# Altium project power_u_V.0.2.PrjPcb
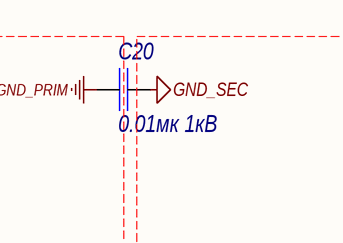
[diagram p0: Sheet2.SchDoc, top left]
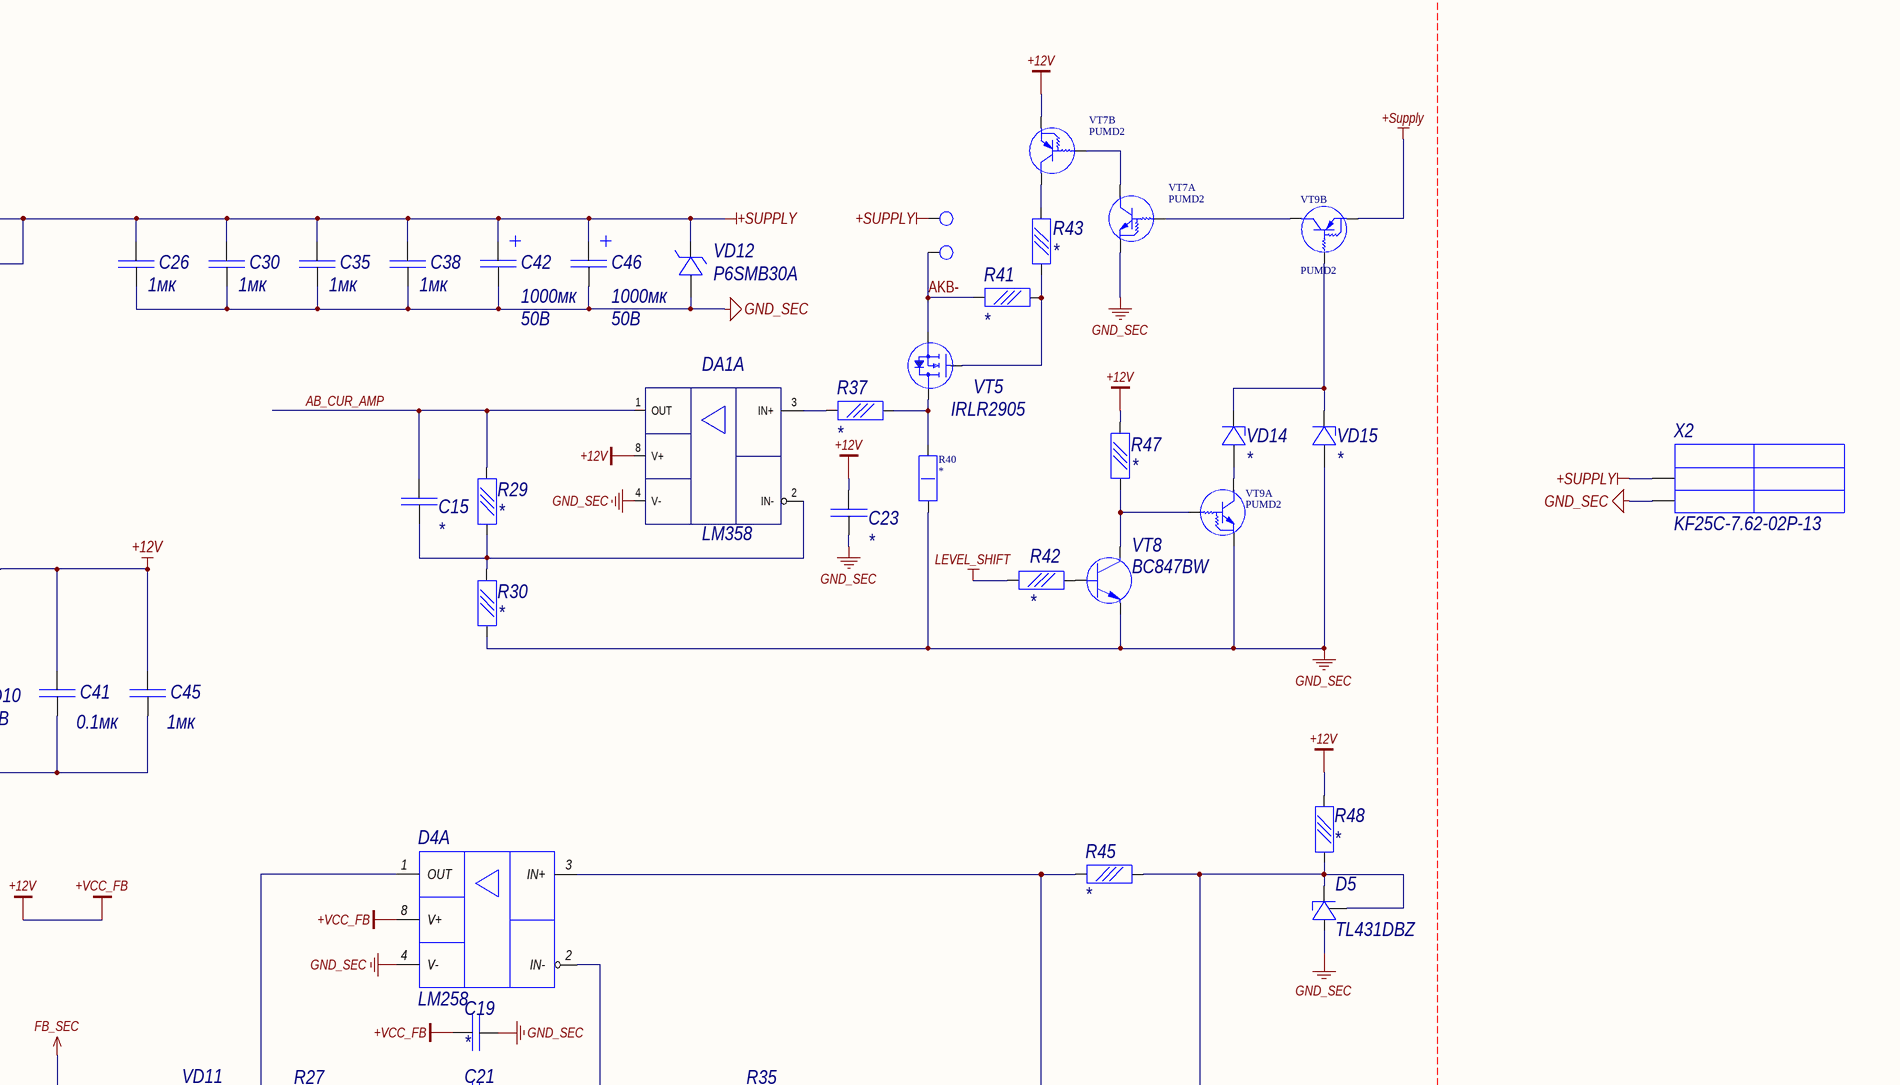
[diagram p1: Sheet2.SchDoc, top right]
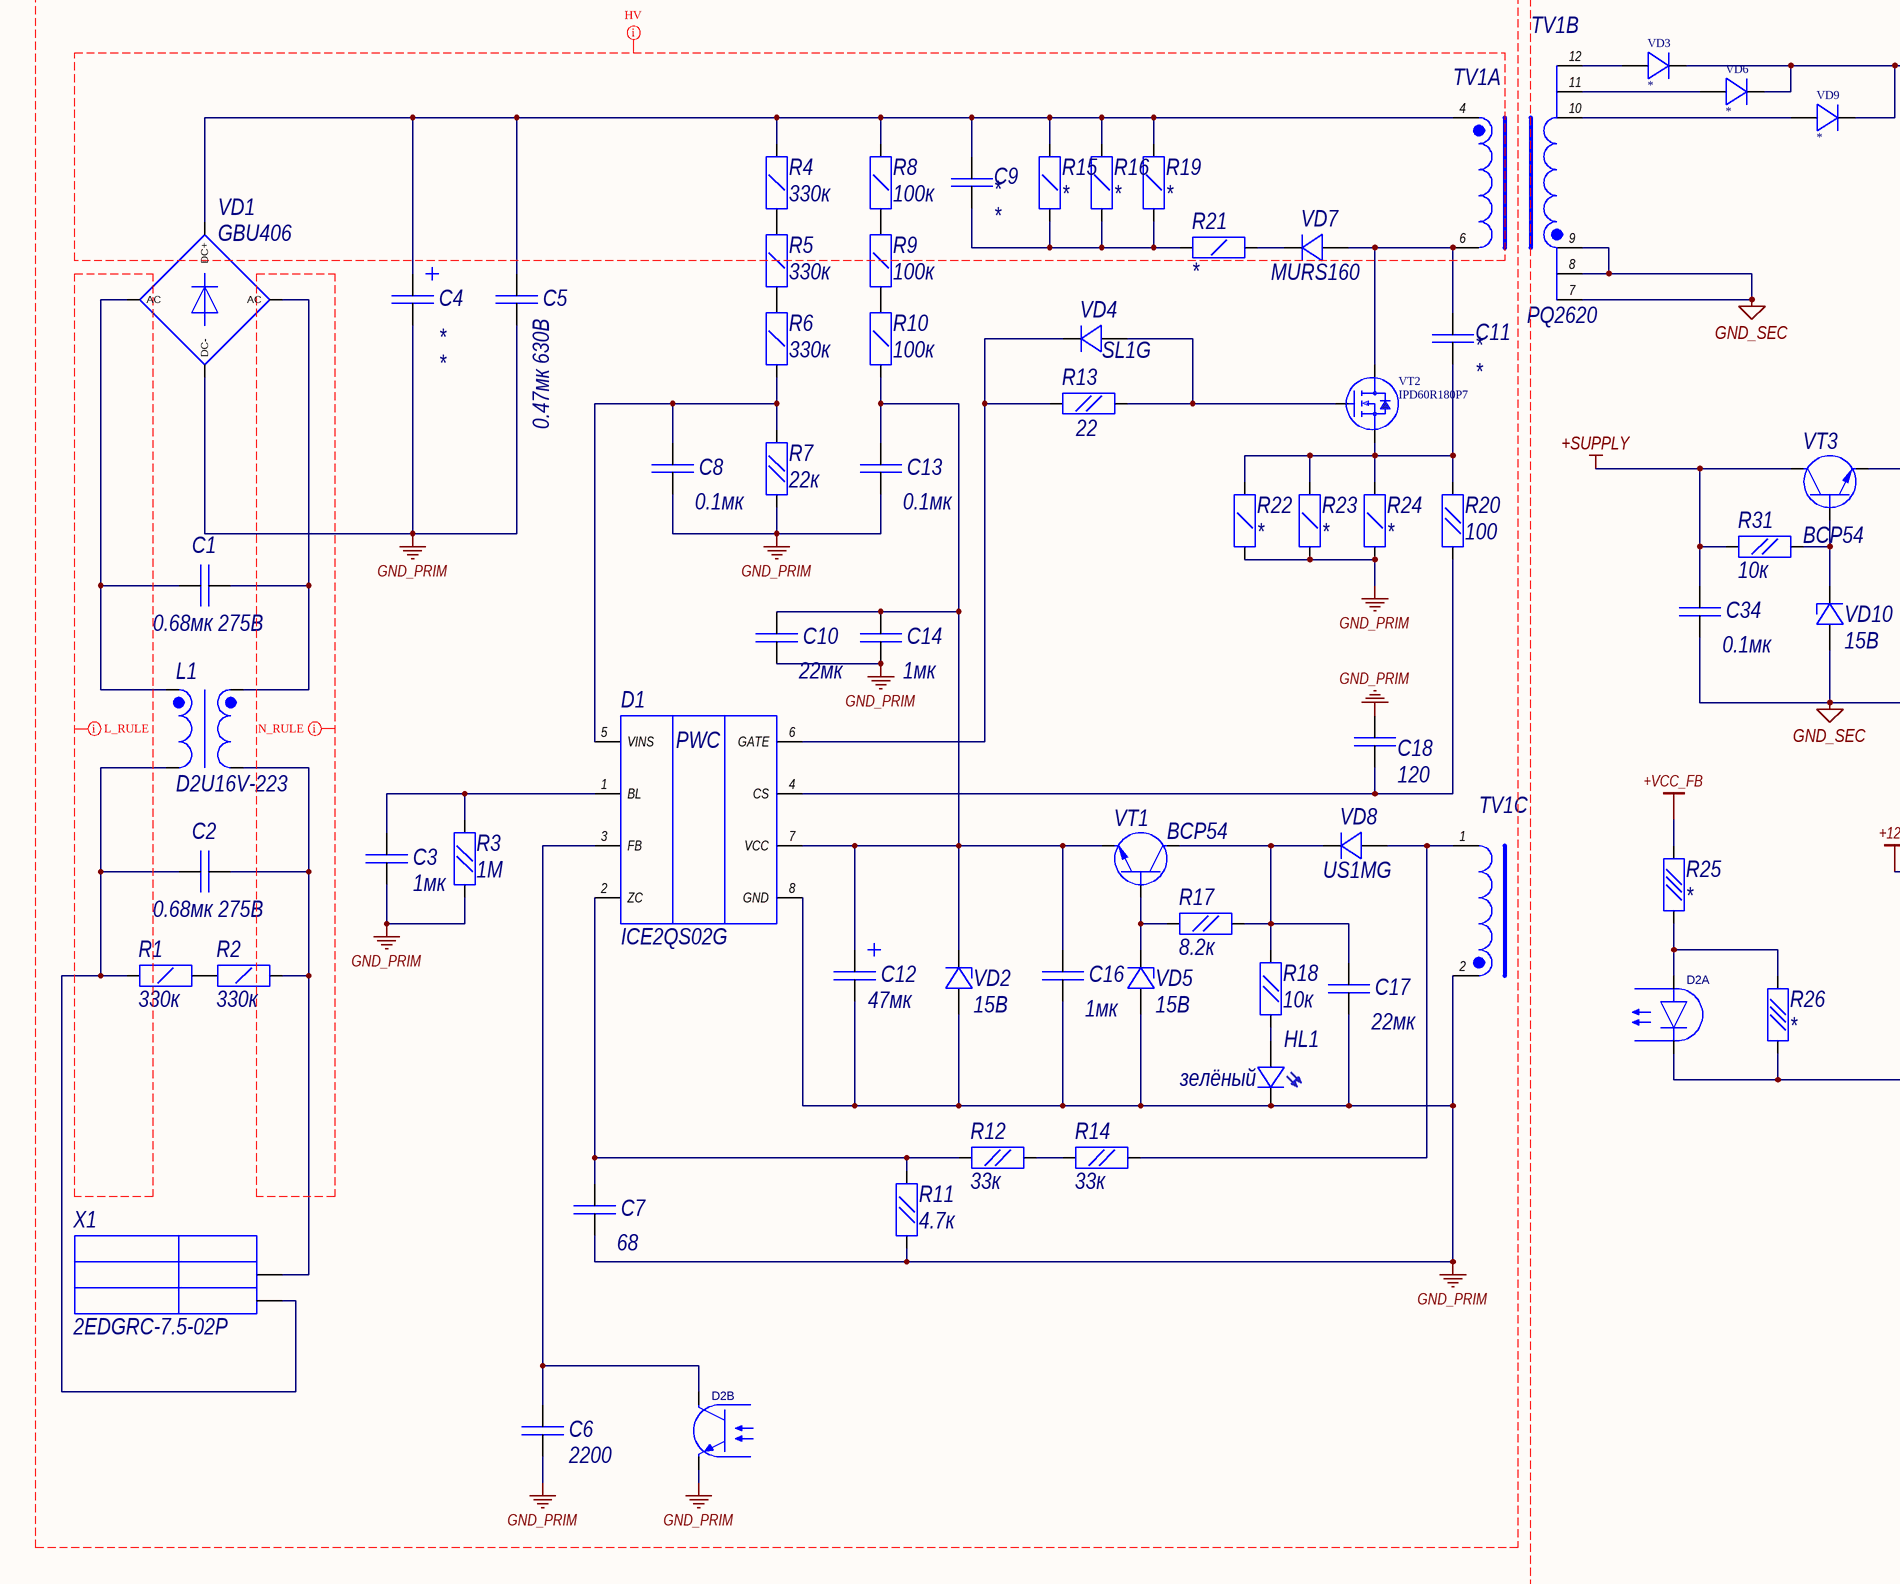
[diagram p2: Sheet2.SchDoc, bottom left]
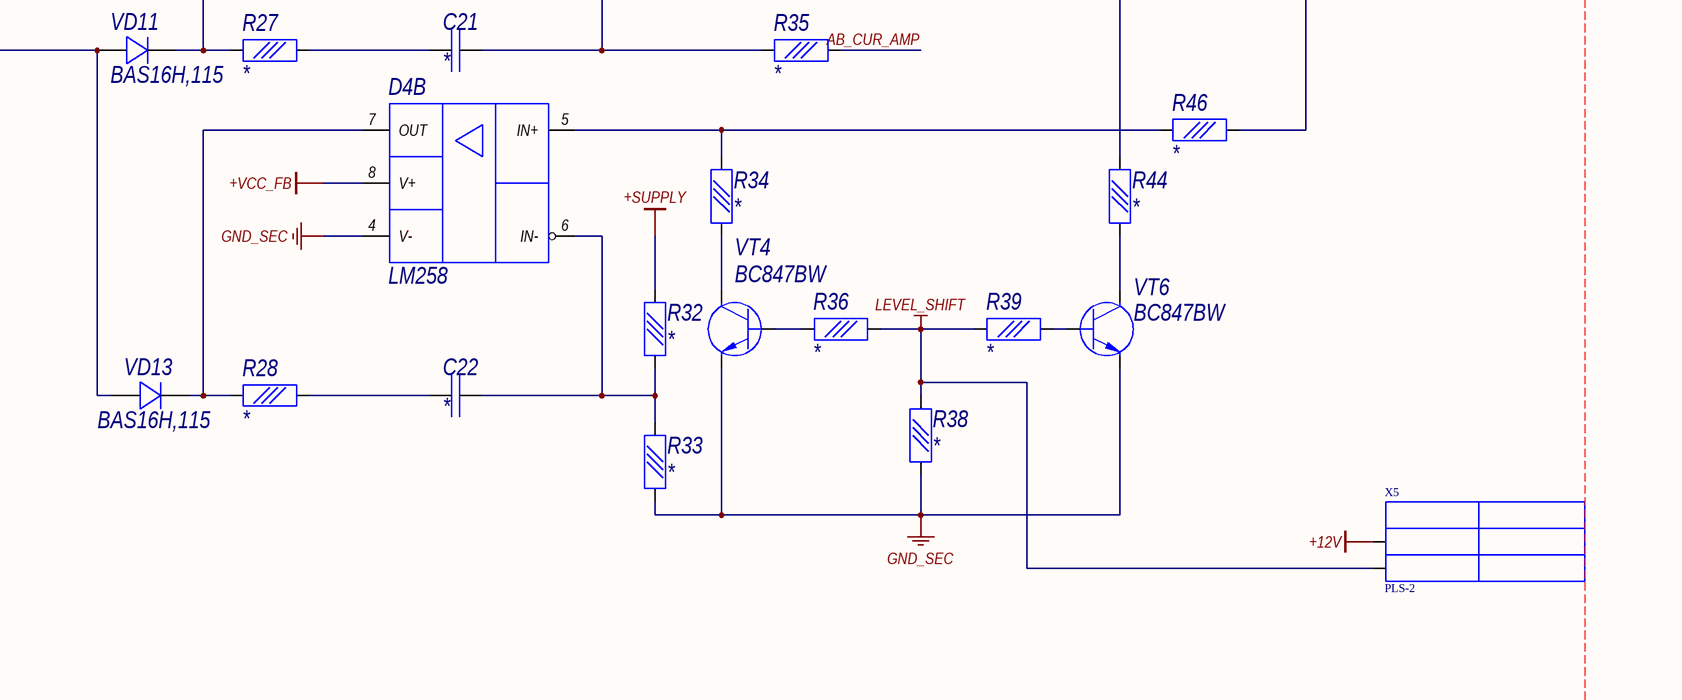
[diagram p3: Sheet2.SchDoc, bottom right]
2 sheets, 127 parts. Net scope: global (net labels, ports and power ports of the same name join across sheets).
Board file: PCB1.PcbDoc
Sheets:
  Sheet2.SchDoc
  Sheet1.SchDoc

## Sheet Sheet2.SchDoc
size 840 x 594 mm; SheetNumber: 1; SheetTotal: 2; Scale: 1:1; Обозначение документа: ААИЧ.425459.001 Э3

### Parts
(Parts that share a designator on the sheet are numbered #1, #2 ... from top to bottom, then left to right.)
C1#1  0.68мк 275В  [FILM_P1500L1800W1100H1400PD80]
C2#1  0.68мк 275В  [FILM_P1500L1800W1100H1400PD80]
C3#1  1мк  [C-0805]
C4  *  [PCAP D18 H36 P7.5]
C5  0.47мк 630В  [CAP23X9X19mm]
C6  2200  [c-0805]
C7#1  68  [c-0805]
C8  0.1мк  [c-0805]
C9  *  [c-1206]
C10  22мк  [c-0805]
C11  *  [c-1206]
C12  47мк  [Capacitor, SM Tantalum; Body 7.3 x 4.3 mm (LxW typ)]
C13  0.1мк  [C-0805]
C14  1мк  [C-0805]
C15  *  [c-0603]
C16  1мк  [C-0805]
C17  22мк  [C-0805]
C18  120  [C-0805]
C19  *  [C-0603]
C20  0.01мк 1кВ  [HVCerCap_d7.5x10]
C21  *  [c-0603]
C22  *  [c-0603]
C23  *  [c-0603]
C26  1мк  [C-0805]
C30  1мк  [C-0805]
C34  0.1мк  [C-0805]
C35  1мк  [C-0805]
C38  1мк  [C-0805]
C41  0.1мк  [C-0805]
C42  1000мк  Voltage: 50В  [CAP: D13C5H25]
C45  1мк  [c-0805]
C46  1000мк  Voltage: 50В  [CAP: D13C5H25]
D1  ICE2QS02G  [8-soic]
D2  PC817  [DIP4-SMD]  (value not drawn)  (parts A,B of 2)
D4  LM258  [8-SOIC]  (parts A,B of 2)
D5  TL431DBZ  [sot-23-3]
DA1  LM358  [8-SOIC]  (part A of 2)
HL1  Color: зелёный  [LED-0805G]  (hidden comment: __GENERIC_LED)
L1#1  D2U16V-223  [UU16]
R1#1  330к  [R-1206]
R2#1  330к  [R-1206]
R3  1М  [R-0805]
R4  330к  [R-1206]
R5  330к  [R-1206]
R6  330к  [R-1206]
R7  22к  [R-0805]
R8  100к  [R-1206]
R9  100к  [R-1206]
R10  100к  [R-1206]
R11  4.7к  [R-0805]
R12  33к  [R-0805]
R13  22  [R-0805]
R14  33к  [R-0805]
R15  *  [R-1206]
R16  *  [R-1206]
R17  8.2к  [R-0805]
R18  10к  [R-0805]
R19  *  [R-1206]
R20  100  [R-0805]
R21  *  [R-1206]
R22  *  [R-1206]
R23  *  [R-1206]
R24  *  [R-1206]
R25  *  [r-0603]
R26  *  [r-0603]
R27  *  [r-0603]
R28  *  [r-0603]
R29  *  [r-0603]
R30  *  [r-0603]
R31  10к  [R-0805]
R32  *  [r-0603]
R33  *  [r-0603]
R34  *  [r-0603]
R35  *  [R-0603]
R36  *  [r-0603]
R37  *  [r-0603]
R38  *  [r-0603]
R39  *  [r-0603]
R40  *  [r-2512]
R41  *  [r-0603]
R42  *  [r-0603]
R43  *  [r-0603]
R44  *  [r-0603]
R45  *  [r-0603]
R46  *  [r-0603]
R47  *  [r-0603]
R48  *  [r-0603]
TV1  PQ3535  [PQ2620]  (value not drawn)  (parts A,B,C of 3)
VD1#1  GBU406  [GBU406]
VD2  15В  [MICROMELF(SOD80)]
VD3  *  [DO-214AC]
VD4  SL1G  [SOD-123FL]
VD5  15В  [MICROMELF(SOD80)]
VD6  *  [DO-214AC]
VD7  MURS160  [DO-214AA]
VD8  US1MG  [DO-214AC]
VD9  *  [DO-214AC]
VD10  15В  [MICROMELF(SOD80)]
VD11  BAS16H,115  [SOD-123FL]
VD12  P6SMB30A  [DO-214AA]
VD13  BAS16H,115  [SOD-123FL]
VD14  *  [MICROMELF(SOD80)]
VD15  *  [MICROMELF(SOD80)]
VT1  BCP54  [SOT-223-4]
VT2  IPD60R180P7  [TO-252]
VT3  BCP54  [SOT-223-4]
VT4  BC847BW  [SOT-323-3]
VT5  IRLR2905  [TO-263-3]
VT6  BC847BW  [SOT-323-3]
VT7  PUMD2  [SOT-323-6]  (parts A,B of 2)
VT8  BC847BW  [SOT-323-3]
VT9  PUMD2  [SOT-323-6]  (parts A,B of 2)
X1  2EDGRC-7.5-02P  [2EDGRC-7.5-02P]
X2#1  KF25C-7.62-02P-13  [KF25C-7.62-02P-13]
X3#1  Клема +  [PAD3MM]  (value not drawn)  (net tie, no BOM)
X4  Клема -  [PAD3MM]  (value not drawn)  (net tie, no BOM)
X5  PLS-2  [PLS-2]

### Nets
+12V: C19.1 C23.2 C41.1 C45.1 D4.8(V+) DA1.8(V+) R25.2 R47.2 R48.1 VT3.3(E) VT7.4(E) X5.1  [also labelled +VCC_FB]
+SUPPLY: C26.2 C30.2 C34.1 C35.2 C38.2 C42.1 C46.1 R31.2 R32.1 VD3.K VD6.K VD9.K VD12.K VT3.2(C) VT9.4(E) X2#1.1 X3#1.1
FB_SEC: D2.2(K) R26.1 VD11.1 VD13.1
GND_PRIM: C3#1.1 C4.2 C5.1 C6.1 C7#1.2 C8.2 C10.2 C12.2 C13.2 C14.2 C16.2 C17.2 C18.2 C20.1 D1.8(GND) D2.3(E) HL1.K R3.2 R7.1 R11.1 R22.1 R23.1 R24.1 TV1.2 VD1#1.-(DC-) VD2.A VD5.A
GND_SEC: C19.2 C20.2 C23.1 C26.1 C30.1 C34.2 C35.1 C38.1 C41.2 C42.2 C45.2 C46.2 D4.4(V-) D5.3(A) DA1.4(V-) R30.2 R33.2 R38.2 R40.1 TV1.7 TV1.8 TV1.9 VD10.A VD12.A VD15.A VT4.2(E) VT6.2(E) VT7.1(E) VT8.2(E) VT9.1(E) X2#1.2
LEVEL_SHIFT: R36.2 R38.1 R39.1 R42.2 X5.2
AB_CUR_AMP: C15.2 DA1.1(OUT) R29.1 R35.1
AKB-: R41.2 VT5.3(S) X4.1
NetC1#1_1: C1#1.1 L1#1.2(S1) VD1#1.AC2(AC)
NetC1#1_2: C1#1.2 L1#1.4(S2) VD1#1.AC1(AC)
NetC2#1_1: C2#1.1 L1#1.1(E1) R1#1.2 X1.2
NetC2#1_2: C2#1.2 L1#1.3(E2) R2#1.1 X1.1
NetC3#1_2: C3#1.2 D1.1(BL) R3.1
NetC4_1: C4.1 C5.2 C9.2 R4.2 R8.2 R15.2 R16.2 R19.2 TV1.4 VD1#1.+(DC+)
NetC6_2: C6.2 D1.3(FB) D2.4(C)
NetC7#1_1: C7#1.1 D1.2(ZC) R11.2 R12.1
NetC8_1: C8.1 D1.5(VINS) R6.1 R7.2
NetC9_1: C9.1 R15.1 R16.1 R19.1 R21.2
NetC10_1: C10.1 C12.1 C13.1 C14.1 C16.1 D1.7(VCC) R10.1 VD2.K VT1.3(E)
NetC11_1: C11.1 R20.1 R22.2 R23.2 R24.2 VT2.S
NetC11_2: C11.2 TV1.6 VD7.A VT2.D
NetC15_1: C15.1 DA1.2(IN-) R29.2 R30.1
NetC17_1: C17.1 R17.1 R18.1 VD8.K VT1.2(C)
NetC18_1: C18.1 D1.4(CS) R20.2
NetC21_1: C21.1 R27.1
NetC21_2: C21.2 D4.2(IN-) R35.2
NetC22_1: C22.1 R28.1
NetC22_2: C22.2 D4.6(IN-) R32.2 R33.1
NetD1_6: D1.6(GATE) R13.1 VD4.K
NetD2_1: D2.1(A) R25.1 R26.2
NetD4_1: D4.1(OUT) R27.2 VD11.2
NetD4_3: D4.3(IN+) R44.2 R45.2
NetD4_5: D4.5(IN+) R34.2 R46.2
NetD4_7: D4.7(OUT) R28.2 VD13.2
NetD5_1: D5.1(K) D5.2(R) R45.1 R46.1 R48.2
NetDA1_3: DA1.3(IN+) R37.2
NetHL1_A: HL1.A R18.2
NetR1#1_1: R1#1.1 R2#1.2
NetR4_1: R4.1 R5.2
NetR5_1: R5.1 R6.2
NetR8_1: R8.1 R9.2
NetR9_1: R9.1 R10.2
NetR12_2: R12.2 R14.1
NetR13_2: R13.2 VD4.A VT2.G
NetR14_2: R14.2 TV1.1 VD8.A
NetR17_2: R17.2 VD5.K VT1.1(B)
NetR21_1: R21.1 VD7.K
NetR31_1: R31.1 VD10.K VT3.1(B)
NetR34_1: R34.1 VT4.3(C)
NetR36_1: R36.1 VT4.1(B)
NetR37_1: R37.1 R40.2 VT5.2(D)
NetR39_2: R39.2 VT6.1(B)
NetR41_1: R41.1 R43.2 VT5.1(G)
NetR42_1: R42.1 VT8.1(B)
NetR43_1: R43.1 VT7.3(C)
NetR44_1: R44.1 VT6.3(C)
NetR47_1: R47.1 VT8.3(C) VT9.2(B)
NetTV1_10: TV1.10 VD9.A
NetTV1_11: TV1.11 VD6.A
NetTV1_12: TV1.12 VD3.A
NetVD14_A: VD14.A VT9.6(C)
NetVD14_K: VD14.K VD15.K VT9.5(B)
NetVT7_2: VT7.2(B) VT9.3(C)
NetVT7_5: VT7.5(B) VT7.6(C)

### Layout directives
net class L: (no net found under the mark)
net class N: (no net found under the mark)
net class HV: (no net found under the mark)
net class PRI: GND_PRIM

### Notes on the sheet
- Перв. примен.
- Справ. №
- Подп. и дата
- Инв. № дубл.
- Взам. инв. №
- Разраб.
- Изм.
- Лист
- № докум.
- Подп.
- Дата
- Лит.
- Масса
- Масштаб
- Пров.
- Т.контр.
- Листов
- Инв. № подл.
- Утв.
- Н.контр.
- Копировал
- Формат А1
- (in symbol ICE2QS02G) PWC

### Library data of the parts
C1#1 C2#1 = FILM_CAP: Конденсатор пленочный; Dielectric: X2; Voltage: 275В; ComponentDescription: =ComponentType+', '+Value+', '+Voltage+', '+Dielectric+', '+Package; ComponentType: Конденсатор пленочный; Package: FILM_P1500L1800W1100H1400PD80; Value: 0.68мк
C3#1 C6 C8 C13 C14 C16 C26 C30 C34 C35 C38 C41 C45 = C0805: Voltage: 50; Dielectric: X7R; ComponentDescription: =ComponentType+', '+Package+', '+Voltage+'В, '+Value+', '+Dielectric; ComponentType: Конденсатор керамический SMD
  C3#1 C14 C16 C26 C30 C35 C38: Package: C-0805; Value: 1мк
  C6: Package: c-0805; Value: 2200
  C8: Package: c-0805; Value: 0.1мк
  C13 C34 C41: Package: C-0805; Value: 0.1мк
  C45: Package: c-0805; Value: 1мк
C4 = Aluminum electrolytic capacitor: Конденсатор электролитический; ComponentDescription: =ComponentType+', '+Value+', '+Voltage+', '+Type+', '+Package; ComponentType: Конденсатор электролитический; Package: PCAP D18 H36 P7.5; Type: *; Voltage: *; Value: *
C5 = CBB22 0.47uF 630V: Конденсатор металло-плёночный; Dielectric: СВВ22; Voltage: 630В; ComponentDescription: =ComponentType+', '+Value+', '+Voltage+', '+Dielectric+', '+Package; ComponentType: Конденсатор металло-плёночный; Package: CAP23X9X19mm; Value: 0.47мк
C7#1 C18 = C0805: Voltage: 50; Dielectric: COG; ComponentDescription: =ComponentType+', '+Package+', '+Voltage+'В, '+Value+', '+Dielectric; ComponentType: Конденсатор керамический SMD
  C7#1: Package: c-0805; Value: 68
  C18: Package: C-0805; Value: 120
C9 C11 = C1206: Voltage: *; ComponentDescription: =ComponentType+', '+Package+', '+Voltage+'В, '+Value+', '+Dielectric; ComponentType: Конденсатор керамический SMD; Dielectric: *; Package: c-1206; Value: *
C10 C17 = C0805: Voltage: 25; Dielectric: X7R; ComponentDescription: =ComponentType+', '+Package+', '+Voltage+'В, '+Value+', '+Dielectric; ComponentType: Конденсатор керамический SMD; Value: 22мк
  C10: Package: c-0805
  C17: Package: C-0805
C12 = _GENERIC_TANTALUM_: Конденсатор танталовый SMD; Voltage: 25; Dielectric: Типоразмер D; ComponentDescription: =ComponentType+', '+Package+', '+Voltage+'В, '+Value+', '+Dielectric; ComponentType: Конденсатор танталовый SMD; Package: Capacitor, SM Tantalum; Body 7.3 x 4.3 mm (LxW typ); Value: 47мк
C15 C19 C21-C23 = C0603: Value: *; ComponentType: Конденсатор керамический SMD; Voltage: *; Dielectric: *; ComponentDescription: =ComponentType+', '+Package+', '+Voltage+'В, '+Value+', '+Dielectric
  C15 C21-C23: Package: c-0603
  C19: Package: C-0603
C20 = HVCerCap_d7.5X10: Конденсатор керамический; Dielectric: Y2; Voltage: 1кВ; ComponentDescription: =ComponentType+', '+Value+', '+Voltage+', '+Dielectric+', '+Package; ComponentType: Конденсатор керамический; Package: HVCerCap_d7.5x10; Value: 0.01мк
C42 C46 = CAP: D13C5H25: Конденсатор электролитический; Type: LOW ESR; Dielectric: ESR; ComponentDescription: =ComponentType+', '+Value+', '+Voltage+', '+Dielectric+', '+Package; ComponentType: Конденсатор электролитический; Package: CAP: D13C5H25; Value: 1000мк
D1 = ICE2QS02G: Микросхема контроллер PWM; ComponentDescription: =ComponentTypе+', '+Comment+', '+Package; ComponentTypе: Микросхема контроллер PWM; Package: 8-soic
D2 = PC817: Оптрон с транзисторным выходом; ComponentDescription: =ComponentType+', '+Comment+', '+Package; Package: DIP4-SMD; ComponentType: Оптрон с транзисторным выходом
D4 = LM258: Микросхема сдвоенный ОУ; ComponentDescription: =ComponentTypе+', '+Comment+', '+Package; ComponentTypе: Микросхема сдвоенный ОУ; Package: 8-SOIC
D5 = TL431DBZ: Микросхема ИОН; ComponentDescription: =ComponentType+', '+Comment+', '+Package; Package: sot-23-3; ComponentType: Микросхема ИОН
DA1 = LMV358: Value: LM358; ComponentDescription: LM358
HL1 = __GENERIC_LED: Светодиод; pin to pad: A>1 K>2; ComponentDescription: =ComponentType+', '+Color+', '+Comment+', '+Package; ComponentType: Светодиод; Package: LED-0805G
L1#1 = U16-123: Дроссель синфазный; ComponentDescription: =ComponentTypе+', '+Comment+', '+Package; ComponentTypе: Дроссель синфазный; Package: UU16
R1#1 R2#1 R4-R6 R8-R10 R15 R16 R19 R21-R24 = R1206: Резистор SMD; Tolerance: 5%; ComponentDescription: =ComponentType+', '+ Package +', '+Value+'Ом, ' + Tolerance; ComponentType: Резистор SMD; Package: R-1206
  R1#1 R2#1 R4-R6: Value: 330к
  R8-R10: Value: 100к
  R15 R16 R19 R21-R24: Value: *
R3 R7 R11-R14 R17 R18 R20 R31 = R0805: Резистор SMD; Tolerance: 5%; ComponentDescription: =ComponentType+', '+ Package +', '+Value+'Ом, ' + Tolerance; ComponentType: Резистор SMD; Package: R-0805
  R3: Value: 1М
  R7: Value: 22к
  R11: Value: 4.7к
  R12 R14: Value: 33к
  R13: Value: 22
  R17: Value: 8.2к
  R18 R31: Value: 10к
  R20: Value: 100
R25-R30 R32-R39 R41-R48 = R0603: Резистор SMD; Tolerance: 5%; Value: *; ComponentType: Резистор SMD; ComponentDescription: =ComponentType+', '+ Package +', '+Value+'Ом, ' + Tolerance
  R25-R30 R32-R34 R36-R39 R41-R48: Package: r-0603
  R35: Package: R-0603
R40 = R2512: Резистор SMD; Tolerance: 5%; ComponentDescription: =ComponentType+', '+ Package +', '+Value+'Ом, ' + Tolerance; ComponentType: Резистор SMD; Package: r-2512; Value: *
TV1 = PQ3535_1: Трансформатор FLYBACK 150WT; ComponentDescription: PQ3535
VD1#1 = GBU406: Диодный мост, однофазный; ComponentDescription: =ComponentType+', '+Comment+', '+Package; ComponentType: Диодный мост, однофазный; Package: GBU406
VD2 VD5 VD10 VD14 VD15 = BZM55: Диод Зенера (стабилитрон); pin to pad: A>1 K>2; ComponentDescription: =ComponentType+', '+ComponentName+' '+Comment+', '+Package; ComponentType: Диод Зенера (стабилитрон); Package: MICROMELF(SOD80); ComponentName: BZM55
VD3 VD6 VD9 = SS22A: Диод выпрямительный одиночный; pin to pad: A>1 K>2; ComponentDescription: =ComponentType+', '+Comment+', '+Package; ComponentType: Диод выпрямительный одиночный; Package: DO-214AC
VD4 = SL1G: Диод выпрямительный одиночный; pin to pad: A>1 K>2; ComponentDescription: =ComponentType+', '+Comment+', '+Package; ComponentType: Диод выпрямительный одиночный; Package: SOD-123FL
VD7 = MURS160: Диод выпрямительный одиночный; pin to pad: A>1 K>2; ComponentDescription: =ComponentType+', '+Comment+', '+Package; ComponentType: Диод выпрямительный одиночный; Package: DO-214AA
VD8 = US1MG: Диод выпрямительный одиночный; pin to pad: A>1 K>2; ComponentDescription: =ComponentType+', '+Comment+', '+Package; ComponentType: Диод выпрямительный одиночный; Package: DO-214AC
VD11 VD13 = BAS16H,115: DIODE GP 100V 215MA SOD-123F; Manufacturer: Nexperia USA Inc.; Capacitance @ Vr, F: 1.5pF @ 0V, 1MHz; Current - Average Rectified (Io): 215mA (DC); Current - Reverse Leakage @ Vr: 500 nA @ 80 V; Diode Type: Standard; Speed: Fast Recovery =< 500ns, > 200mA (Io); Voltage - Forward (Vf) (Max) @ If: 1.25 V @ 150 mA; Reverse Recovery Time (trr): 4 ns; Part Number: BAS16H,115; Component Kind: Standard; Component Type: Standard; ComponentLink2Description: DigiKey Link; ComponentLink2URL: https://www.digikey.com/en/products/detail/nexperia-usa-inc/BAS16H-115/1163692; LastUpdated: 19.09.2022 13:46:32; Lifecycle Status: Active; Minimum Order: 1; Mounting Type: Surface Mount; Packaging: TapeAndReel; PartId: 1129; Pin Count: 2; Price: 0.02; Supplier 1: DigiKey; Supplier Device Package: SOD-123F; Supplier Part Number 1: 1727-4796-1-ND; Voltage - DC Reverse (Vr) (Max): 100 V; ComponentLink1Description: Datasheet; ComponentLink1URL: https://assets.nexperia.com/DO-cuments/data-sheet/BAS16_SER.pdf; Operating Temperature - Junction: 150°C (Max); Part Status: Active; Series: Automotive, AEC-Q101, BAS16; Package / Case: SOD-123F
VD12 = P6SMB30A: Защитный диод униполярный; pin to pad: A>1 K>2; ComponentDescription: =ComponentType+', '+Comment+', '+Package; ComponentType: Защитный диод униполярный; Package: DO-214AA
VT1 VT3 = BCP54: ChannelType: NPN; ComponentType: Транзистор биполярный; Package: SOT-223-4; ComponentDescription: =ComponentType+', '+ChannelType+', '+Comment+', '+Package
VT2 = IPD60R180P7: Транзистор МОП, одиночный, N-канальный; pin to pad: D>4 G>1 S>3; ComponentDescription: =ComponentType+', '+ChannelType+', '+Comment+', '+Package; ChannelType: N-канальный; ComponentType: Транзистор МОП, одиночный; Package: TO-252
VT4 VT6 VT8 = BC847BW: ChannelType: NPN; ComponentType: Транзистор биполярный; ComponentDescription: =ComponentType+', '+ChannelType+', '+Comment+', '+Package; Package: SOT-323-3
VT7 VT9 = PUMD2: ChannelType: NPN-PNP; ComponentDescription: =ComponentType+', '+ChannelType+', '+Comment+', '+Package; ComponentType: Цифровая сборка; Package: SOT-323-6
X1 = 2EDGRC-7.5-02P: Разъем разрывной; ComponentDescription: Разъём, 2EDGRC-7.5-02P; ComponentTypе: Разъём
X2#1 = KF25C-7.62-02P-13: Разъём винтовой; ComponentDescription: Разъём винтовой, KF25C-7.62-02P-13; ComponentTypе: Разъём винтовой
X3#1 X4 = PAD1mm
X5 = PLS-2: Разъём штыревой; ComponentDescription: Разъём штыревой, PLS-2; ComponentTypе: Разъём штыревой
VT5 = IRLR2905: ComponentDescription: IRLR2905; Value: IRLR2905

## Sheet Sheet1.SchDoc
size A3; SheetNumber: 2; SheetTotal: 2
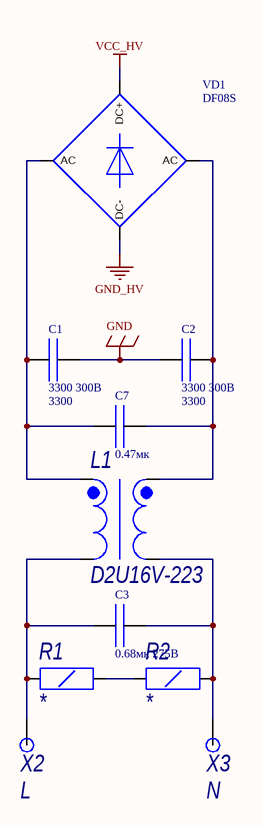
[diagram p4: Sheet1.SchDoc]

### Parts
(Parts that share a designator on the sheet are numbered #1, #2 ... from top to bottom, then left to right.)
C1#2  3300 300В  value 3300  [HVCerCap_d7.5x10]
C2#2  3300 300В  value 3300  [HVCerCap_d7.5x10]
C3#2  0.68мк 275В  [FILM_P1500L1800W1100H1400PD80]
C7#2  value 0.47мк  [CAP23X9X19mm]  (hidden comment: 0.47мк 630В)
L1#2  D2U16V-223  [UU16]
R1#2  *  [R-1206]
R2#2  *  [R-1206]
VD1#2  DF08S  [SDIP 4L]
X2#2  L  [PAD_TOP_10x10]  (net tie, no BOM)
X3#2  N  [PAD_TOP_10x10]  (net tie, no BOM)

### Nets
GND: C1#2.2 C2#2.1
GND_HV: VD1#2.DC-
VCC_HV: VD1#2.DC+
NetC1#2_1: C1#2.1 C7#2.1 L1#2.4(S2) VD1#2.AC2(AC)
NetC2#2_2: C2#2.2 C7#2.2 L1#2.2(S1) VD1#2.AC1(AC)
NetC3#2_1: C3#2.1 L1#2.3(E2) R1#2.1 X2#2.1
NetC3#2_2: C3#2.2 L1#2.1(E1) R2#2.2 X3#2.1
NetR1#2_2: R1#2.2 R2#2.1

### Library data of the parts
C1#2 C2#2 = HVCerCap_d7.5X10: Конденсатор керамический; Dielectric: Y2; Voltage: 300В; ComponentDescription: =ComponentType+', '+Value+', '+Voltage+', '+Dielectric+', '+Package; ComponentType: Конденсатор керамический; Package: HVCerCap_d7.5x10
C3#2 = FILM_CAP: Конденсатор пленочный; Dielectric: X2; Voltage: 275В; ComponentDescription: =ComponentType+', '+Value+', '+Voltage+', '+Dielectric+', '+Package; ComponentType: Конденсатор пленочный; Package: FILM_P1500L1800W1100H1400PD80; Value: 0.68мк
C7#2 = CBB22 0.47uF 630V: as C5 on sheet Sheet2; Voltage: 630В; ComponentDescription: =ComponentType+', '+Value+', '+Voltage+', '+Dielectric+', '+Package; ComponentType: Конденсатор металло-плёночный; Package: CAP23X9X19mm
L1#2 = D2U16V-223: Дроссель синфазный; ComponentDescription: =ComponentTypе+', '+Comment+', '+Package; ComponentTypе: Дроссель синфазный; Package: UU16
R1#2 R2#2 = R1206: Резистор SMD; Tolerance: 5%; ComponentDescription: =ComponentType+', '+ Package +', '+Value+'Ом, ' + Tolerance; ComponentType: Резистор SMD; Package: R-1206; Value: *
VD1#2 = DF08S: Диодный мост, однофазный; pin to pad: AC1>1 AC2>2 DC+>3 DC->4; ComponentType: Диодный мост, однофазный; Package: SDIP 4L; ComponentDescription: =ComponentType+', '+Comment+', '+Package
X2#2 X3#2 = PAD: Контакт